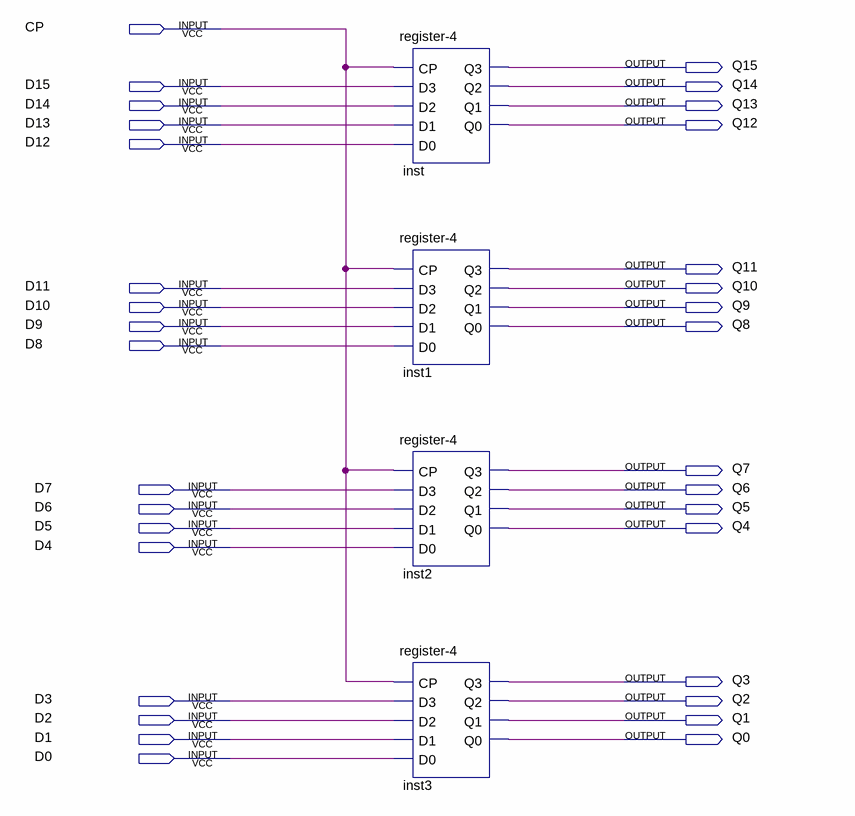
[diagram p0: schematic sheet]
// Quartus schematic register-16.bdf as structural Verilog: 4 symbols, 33 pins
module \register-16  (
  input  CP,
  input  D15,
  input  D14,
  input  D13,
  input  D12,
  input  D11,
  input  D10,
  input  D9,
  input  D8,
  input  D7,
  input  D6,
  input  D5,
  input  D4,
  input  D3,
  input  D2,
  input  D1,
  input  D0,
  output Q15,
  output Q14,
  output Q13,
  output Q12,
  output Q11,
  output Q10,
  output Q9,
  output Q8,
  output Q7,
  output Q6,
  output Q5,
  output Q4,
  output Q3,
  output Q2,
  output Q1,
  output Q0
);

  \register-4  inst (.CP(CP), .D3(D15), .D2(D14), .D1(D13), .D0(D12), .Q3(Q15), .Q2(Q14), .Q1(Q13), .Q0(Q12));
  \register-4  inst1 (.CP(CP), .D3(D11), .D2(D10), .D1(D9), .D0(D8), .Q3(Q11), .Q2(Q10), .Q1(Q9), .Q0(Q8));
  \register-4  inst2 (.CP(CP), .D3(D7), .D2(D6), .D1(D5), .D0(D4), .Q3(Q7), .Q2(Q6), .Q1(Q5), .Q0(Q4));
  \register-4  inst3 (.CP(CP), .D3(D3), .D2(D2), .D1(D1), .D0(D0), .Q3(Q3), .Q2(Q2), .Q1(Q1), .Q0(Q0));
endmodule
